# Altium schematic sheet tavolsagszenzorok.SchDoc
size A4
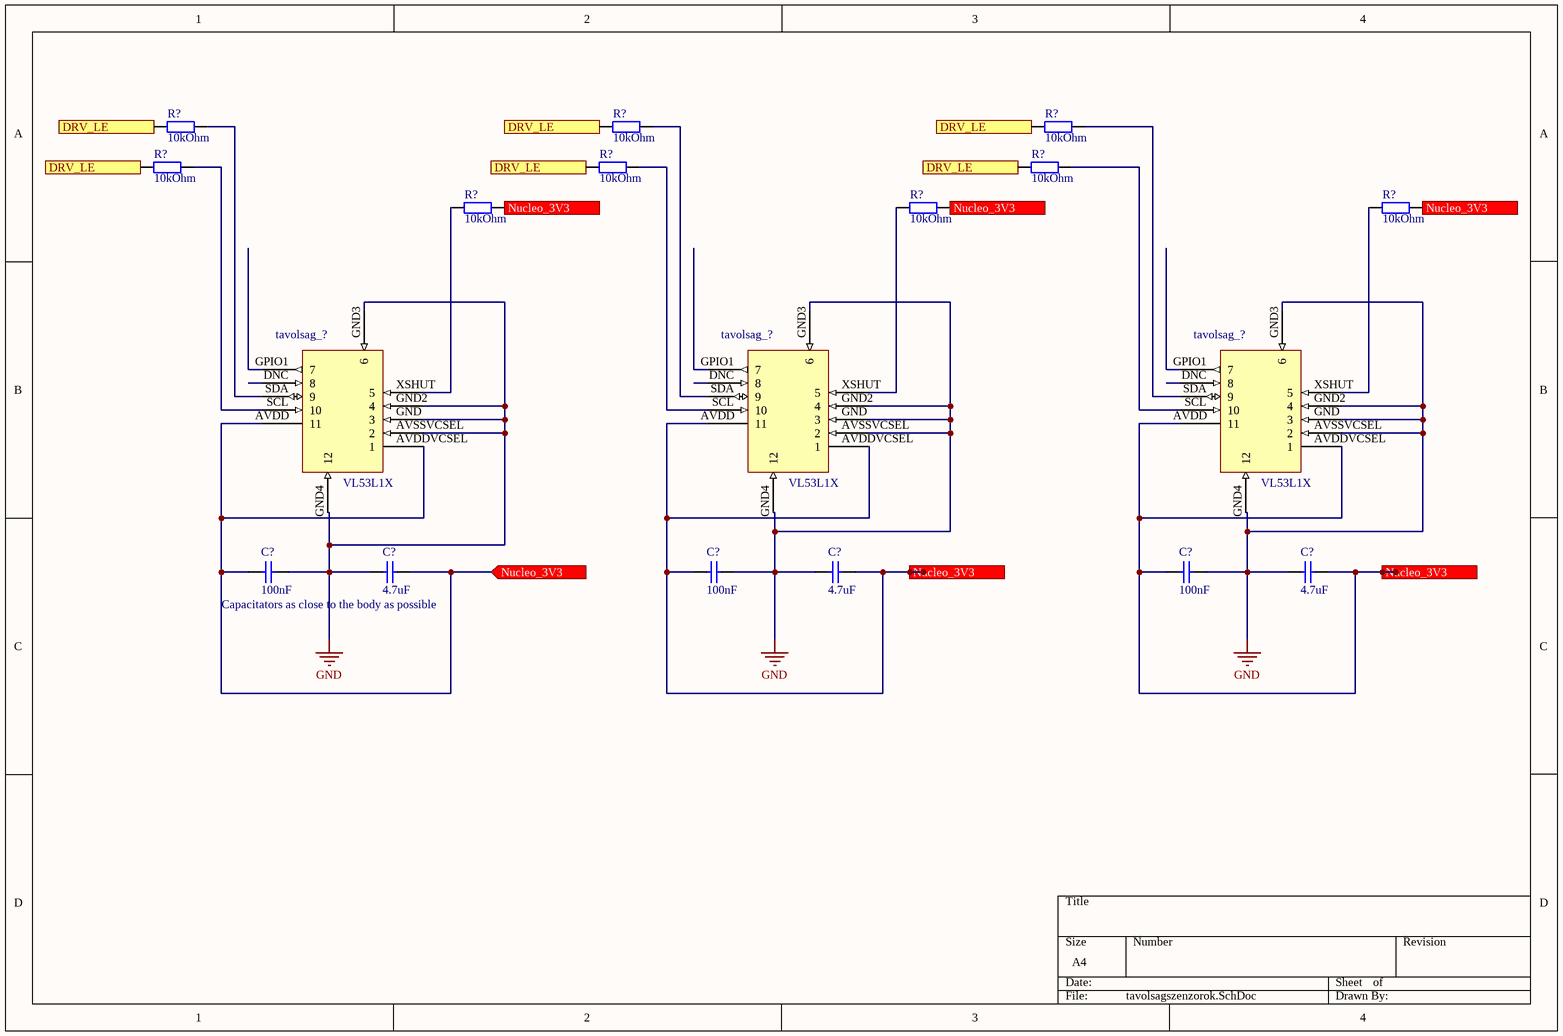
[diagram p0: tavolsagszenzorok.SchDoc]

## Parts
(Parts that share a designator on the sheet are numbered #1, #2 ... from top to bottom, then left to right.)
C?#1  100nF  [FP_0402_CAP_050]
C?#2  4.7uF  [FP_0402_CAP_050]
C?#3  100nF  [FP_0402_CAP_050]
C?#4  4.7uF  [FP_0402_CAP_050]
C?#5  100nF  [FP_0402_CAP_050]
C?#6  4.7uF  [FP_0402_CAP_050]
R?#1  10kOhm  [FP_0603_RES]
R?#2  10kOhm  [FP_0603_RES]
R?#3  10kOhm  [FP_0603_RES]
R?#4  10kOhm  [FP_0603_RES]
R?#5  10kOhm  [FP_0603_RES]
R?#6  10kOhm  [FP_0603_RES]
R?#7  10kOhm  [FP_0603_RES]
R?#8  10kOhm  [FP_0603_RES]
R?#9  10kOhm  [FP_0603_RES]
tavolsag_?#1  VL53L1X
tavolsag_?#2  VL53L1X
tavolsag_?#3  VL53L1X

## Ports
DRV_LE (out), Nucleo_3V3 (in)

## Nets
GND: C?#1.2 C?#2.1 C?#3.2 C?#4.1 C?#5.2 C?#6.1 tavolsag_?#1.AVSSVCSEL(2) tavolsag_?#1.GND(3) tavolsag_?#1.GND2(4) tavolsag_?#1.GND3(6) tavolsag_?#1.GND4(12) tavolsag_?#2.AVSSVCSEL(2) tavolsag_?#2.GND(3) tavolsag_?#2.GND2(4) tavolsag_?#2.GND3(6) tavolsag_?#2.GND4(12) tavolsag_?#3.AVSSVCSEL(2) tavolsag_?#3.GND(3) tavolsag_?#3.GND2(4) tavolsag_?#3.GND3(6) tavolsag_?#3.GND4(12)
DRV_LE: R?#1.1 R?#2.1 R?#3.1 R?#4.1 R?#5.1 R?#6.1 ; port DRV_LE
Nucleo_3V3: C?#1.1 C?#2.2 C?#3.1 C?#4.2 C?#5.1 C?#6.2 R?#7.2 R?#8.2 R?#9.2 tavolsag_?#1.AVDD(11) tavolsag_?#1.AVDDVCSEL(1) tavolsag_?#2.AVDD(11) tavolsag_?#2.AVDDVCSEL(1) tavolsag_?#3.AVDD(11) tavolsag_?#3.AVDDVCSEL(1) ; port Nucleo_3V3
NetR?#1_2: R?#1.2 tavolsag_?#1.SDA(9)
NetR?#2_2: R?#2.2 tavolsag_?#2.SDA(9)
NetR?#3_2: R?#3.2 tavolsag_?#3.SDA(9)
NetR?#4_2: R?#4.2 tavolsag_?#1.SCL(10)
NetR?#5_2: R?#5.2 tavolsag_?#2.SCL(10)
NetR?#6_2: R?#6.2 tavolsag_?#3.SCL(10)
NetR?#7_1: R?#7.1 tavolsag_?#1.XSHUT(5)
NetR?#8_1: R?#8.1 tavolsag_?#2.XSHUT(5)
NetR?#9_1: R?#9.1 tavolsag_?#3.XSHUT(5)

Not connected (* = marked no-connect by the designer): tavolsag_?#1 DNC(8) GPIO1(7); tavolsag_?#2 DNC(8) GPIO1(7); tavolsag_?#3 DNC(8) GPIO1(7)

## Notes on the sheet
- (near C?#1) Capacitators as close to the body as possible

## Library data of the parts
C?#1-C?#6 = CAP: Capacitor
  C?#1 C?#3 C?#5: Value: 100nF
  C?#2 C?#4 C?#6: Value: 4.7uF
R?#1-R?#9 = RES: Resistor; Value: 10kOhm
tavolsag_?#1-tavolsag_?#3 = VL53L1X: tavolsagszenzor